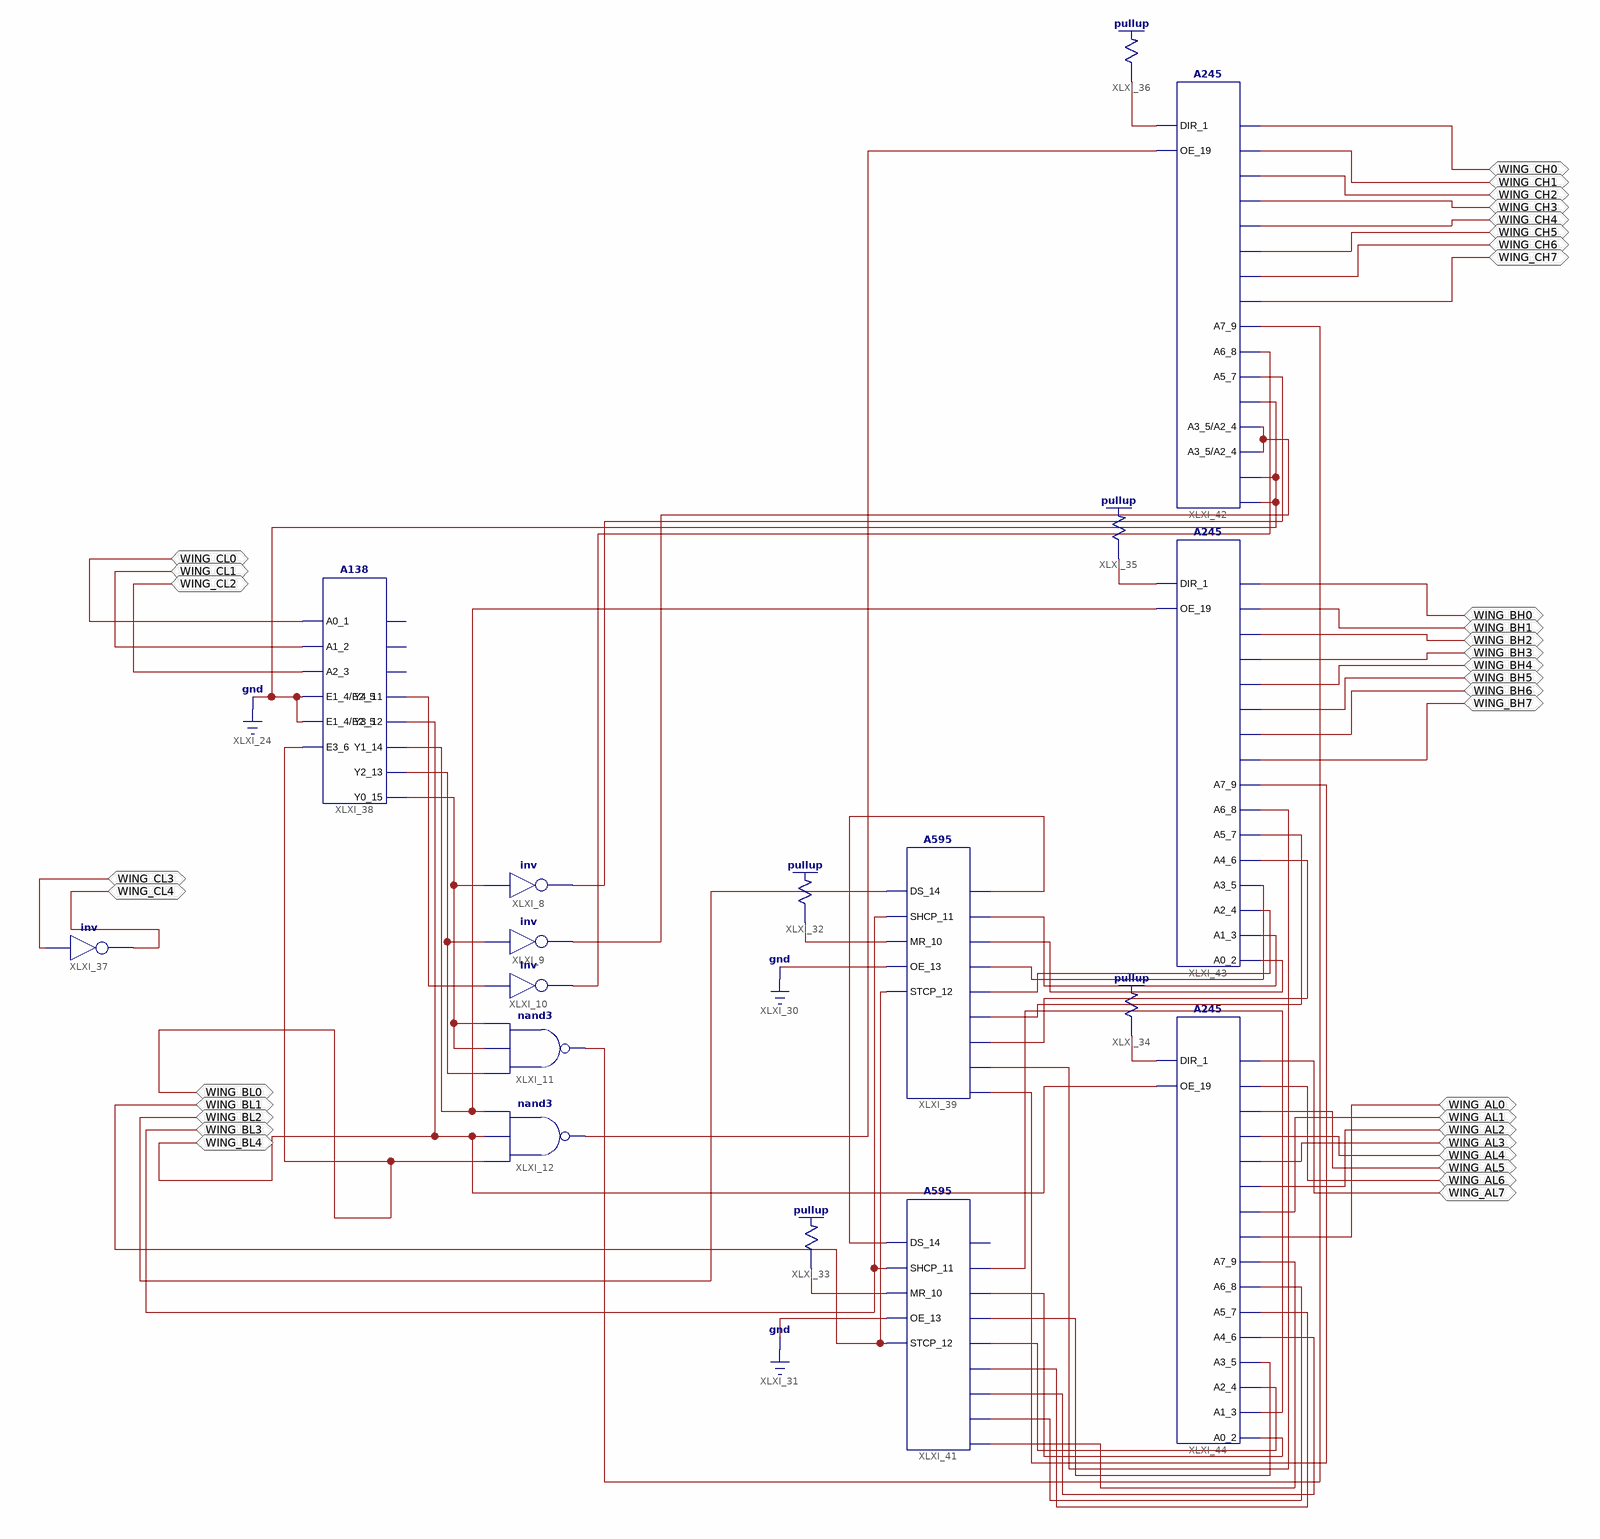
[diagram p0: schematic sheet 1]
// Xilinx ISE schematic Papilio_One_250K.sch (spartan3e) as structural Verilog: 17 symbols, 34 ports
module Papilio_One_250K (
  inout  WING_CL0,
  inout  WING_CL1,
  inout  WING_CL2,
  inout  WING_CL3,
  inout  WING_CL4,
  inout  WING_BL0,
  inout  WING_BL1,
  inout  WING_BL2,
  inout  WING_BL3,
  inout  WING_BL4,
  inout  WING_CH0,
  inout  WING_CH1,
  inout  WING_CH2,
  inout  WING_CH3,
  inout  WING_CH4,
  inout  WING_CH5,
  inout  WING_CH6,
  inout  WING_CH7,
  inout  WING_BH0,
  inout  WING_BH1,
  inout  WING_BH2,
  inout  WING_BH3,
  inout  WING_BH4,
  inout  WING_BH5,
  inout  WING_BH6,
  inout  WING_BH7,
  inout  WING_AL0,
  inout  WING_AL1,
  inout  WING_AL2,
  inout  WING_AL3,
  inout  WING_AL4,
  inout  WING_AL5,
  inout  WING_AL6,
  inout  WING_AL7
);

  wire XLXN_2, XLXN_5, XLXN_9, XLXN_20, XLXN_31, XLXN_32, XLXN_33, XLXN_34, XLXN_35, XLXN_36, XLXN_41,
       XLXN_42, XLXN_44, XLXN_45, XLXN_46, XLXN_47, XLXN_48, XLXN_49, XLXN_50, XLXN_51, XLXN_52, XLXN_53,
       XLXN_54, XLXN_55, XLXN_56, XLXN_57, XLXN_58, XLXN_59, XLXN_61, XLXN_62, XLXN_63;

  nand XLXI_11 (XLXN_34, XLXN_5, XLXN_2, XLXN_2);
  nand XLXI_12 (XLXN_35, WING_BL0, WING_BL4, XLXN_36);
  not XLXI_10 (XLXN_33, XLXN_9);
  not XLXI_9 (XLXN_31, XLXN_5);
  not XLXI_8 (XLXN_32, XLXN_2);
  \pullup  XLXI_32 (.O(XLXN_41));
  \pullup  XLXI_33 (.O(XLXN_42));
  \pullup  XLXI_34 (.O(XLXN_63));
  \pullup  XLXI_35 (.O(XLXN_62));
  \pullup  XLXI_36 (.O(XLXN_61));
  not XLXI_37 (WING_CL4, WING_CL3);
  A138 XLXI_38 (
    .A0_1(WING_CL0), .A1_2(WING_CL1), .A2_3(WING_CL2), .E1_4(1'b0), .E2_5(1'b0), .E3_6(WING_BL0),
    .Y4_11(XLXN_9), .Y3_12(WING_BL4), .Y1_14(XLXN_36), .Y2_13(XLXN_5), .Y0_15(XLXN_2));  // open: Y7_7, Y6_9, Y5_10
  A595 XLXI_39 (
    .DS_14(WING_BL2), .SHCP_11(WING_BL3), .MR_10(XLXN_41), .OE_13(1'b0), .STCP_12(WING_BL1));  // open: Q7S_9, Q1_1, Q0_15, Q3_3, Q2_2, Q5_5, Q4_4, Q6_6, Q7_7
  A595 XLXI_41 (
    .DS_14(XLXN_20), .SHCP_11(WING_BL3), .MR_10(XLXN_42), .OE_13(1'b0), .STCP_12(WING_BL1));  // open: Q7S_9, Q1_1, Q0_15, Q3_3, Q2_2, Q5_5, Q4_4, Q6_6, Q7_7
  A245 XLXI_42 (
    .DIR_1(XLXN_61), .OE_19(XLXN_35), .A7_9(XLXN_34), .A6_8(XLXN_33), .A5_7(XLXN_32), .A4_6(1'b0),
    .A3_5(XLXN_31), .A2_4(XLXN_31), .A1_3(1'b0), .A0_2(1'b0));  // open: B0_18, B1_17, B2_16, B3_15, B4_14, B5_13, B6_12, B7_11
  A245 XLXI_43 (
    .DIR_1(XLXN_62), .OE_19(XLXN_36), .A7_9(XLXN_51), .A6_8(XLXN_50), .A5_7(XLXN_49), .A4_6(XLXN_48),
    .A3_5(XLXN_47), .A2_4(XLXN_46), .A1_3(XLXN_45), .A0_2(XLXN_44));  // open: B0_18, B1_17, B2_16, B3_15, B4_14, B5_13, B6_12, B7_11
  A245 XLXI_44 (
    .DIR_1(XLXN_63), .OE_19(WING_BL4), .A7_9(XLXN_59), .A6_8(XLXN_58), .A5_7(XLXN_57), .A4_6(XLXN_56),
    .A3_5(XLXN_55), .A2_4(XLXN_54), .A1_3(XLXN_53), .A0_2(XLXN_52));  // open: B0_18, B1_17, B2_16, B3_15, B4_14, B5_13, B6_12, B7_11
endmodule
